# Altium schematic sheet ISP1507.SchDoc
size 420 x 297 mm; ApprovedBy: Утвердил; CheckedBy: Проверил; Author: Разработал; CompanyName: ВлГУ; DrawnBy: Н.Контр; Engineer: Т.Контр; SheetNumber: 2; SheetTotal: 1; PageSetup: Record=PageOptions|CenterHorizontal=True|CenterVertical=True|PrintScale=0.94|XCorrection=1.00|YCorrection=1.00|PrintKind=1|BorderSize=5000000|LeftOffset=0|BottomOffset=0|Orientation=1|PaperLength=1000|PaperWidth=1000|Scale=100|PaperSource=7|PrintQuality=-4|MediaType=1|DitherType=10|PaperKind=A4|PrintScaleMode=1; HeadOfSector: Нач. сектора; MainDevice: Перв.примен.; Name: Наименование; DocumentName: Sheet1.SCHDOC
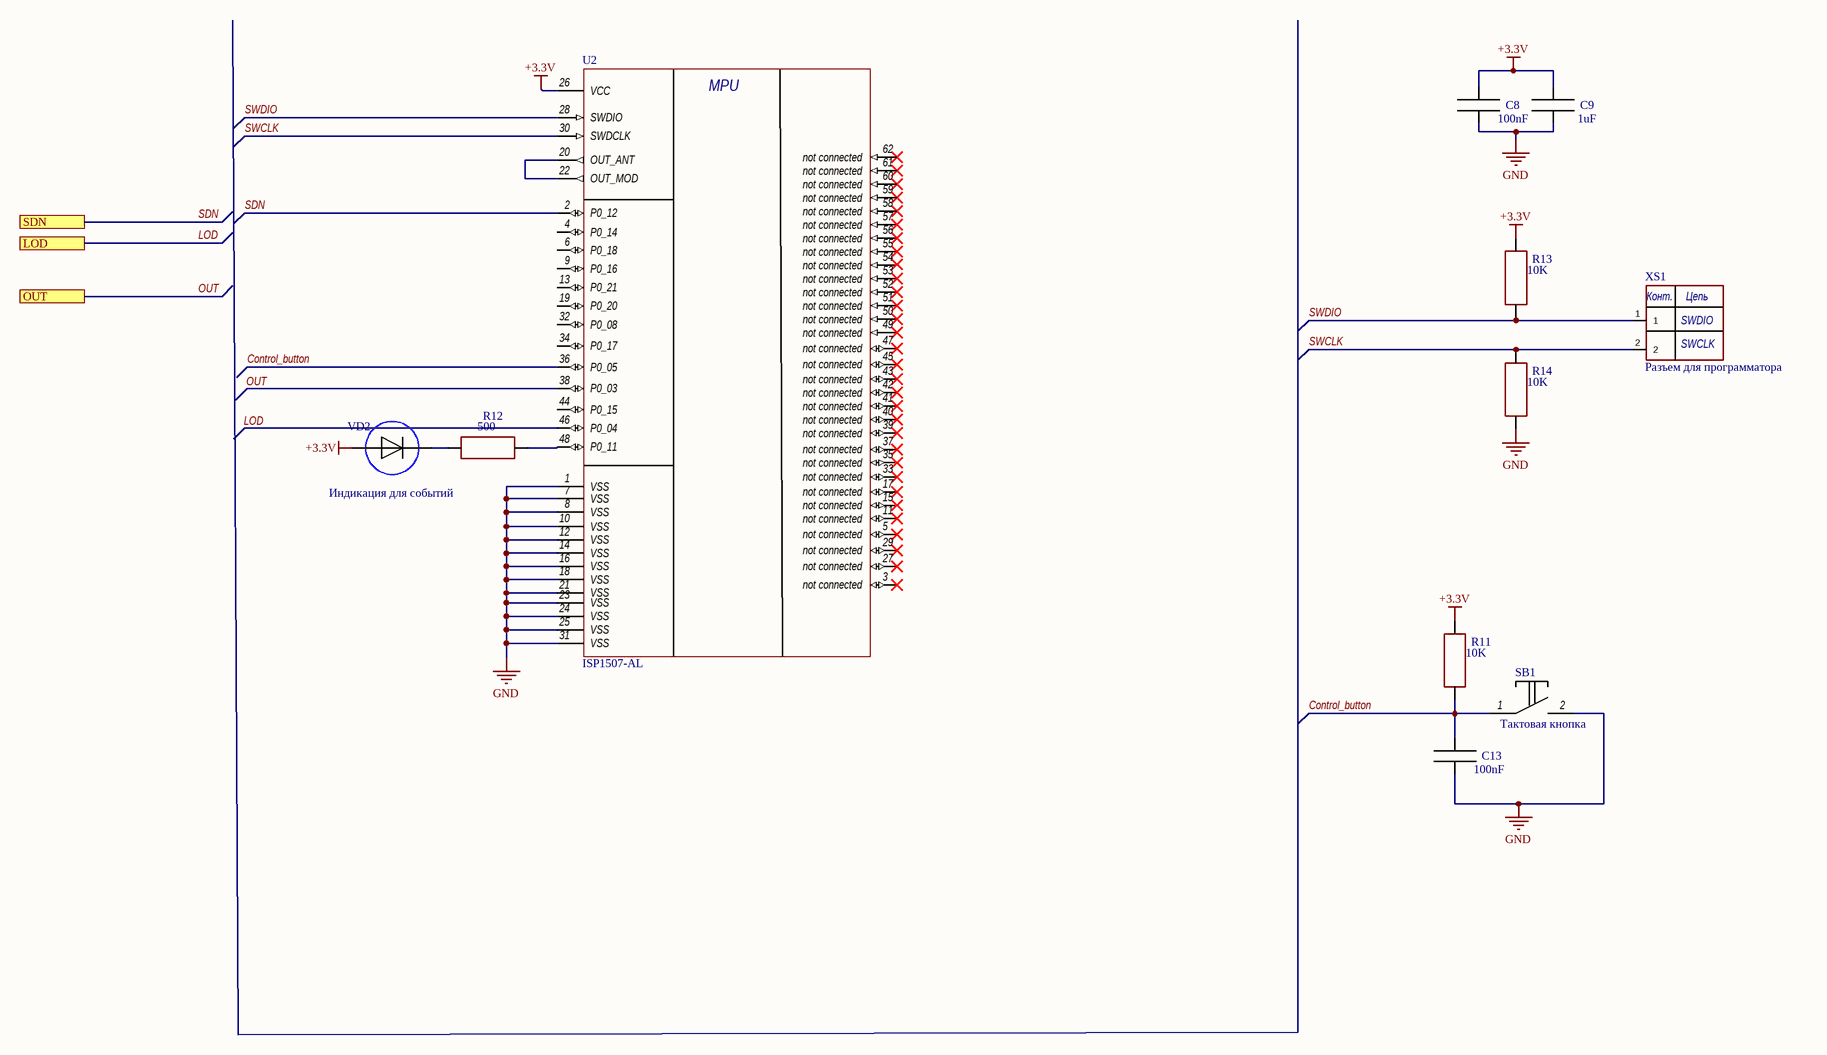
[diagram p0: ISP1507.SchDoc]

## Parts
C8  100nF  [0402]
C9  1uF  [0402]
C13  100nF  [0402]
R11  10K  [0402]
R12  500  [0402]
R13  10K  [0402]
R14  10K  [0402]
SB1  Тактовая кнопка  [2565]
U2  ISP1507-AL  [LGA QFN]
VD2  Event  [0402]  (value not drawn)
XS1  Разъем для программатора  [PIN 2]

## Ports
LOD, OUT, SDN

## Nets
+3.3V: C8.2 C9.2 R11.2 R13.2 U2.26(VCC) VD2.1
GND: C8.1 C9.1 C13.1 R14.1 SB1.2 U2.1(VSS) U2.7(VSS) U2.8(VSS) U2.10(VSS) U2.12(VSS) U2.14(VSS) U2.16(VSS) U2.18(VSS) U2.21(VSS) U2.23(VSS) U2.24(VSS) U2.25(VSS) U2.31(VSS)
Control_button: C13.2 R11.1 SB1.1 U2.36(P0_05)
LOD: port LOD
OUT: U2.38(P0_03) ; port OUT
SDN: U2.2(P0_12) ; port SDN
SWCLK: R14.2 U2.30(SWDCLK) XS1.2
SWDIO: R13.1 U2.28(SWDIO) XS1.1
NetR12_1: R12.1 U2.48(P0_11)
NetR12_2: R12.2 VD2.2
NetU2_20: U2.20(OUT_ANT) U2.22(OUT_MOD)

Not connected (* = marked no-connect by the designer): U2 3(not_connected)* 4(P0_14) 5(not_connected)* 6(P0_18) 9(P0_16) 11(not_connected)* 13(P0_21) 15(not_connected)* 17(not_connected)* 19(P0_20) 27(not_connected)* 29(not_connected)* 32(P0_08) 33(not_connected)* 34(P0_17) 35(not_connected)* 37(not_connected)* 39(not_connected)* 40(not_connected)* 41(not_connected)* 42(not_connected)* 43(not_connected)* 44(P0_15) 45(not_connected)* 46(P0_04) 47(not_connected)* 49(not_connected)* 50(not_connected)* 51(not_connected)* 52(not_connected)* 53(not_connected)* 54(not_connected) 55(not_connected)* 56(not_connected)* 57(not_connected)* 58(not_connected)* 59(not_connected)* 60(not_connected)* 61(not_connected)* 62(not_connected)*

## Notes on the sheet
- (near XS1) SWDIO
- (near XS1) SWCLK
- Индикация для событий
- Labels drawn without touching a wire or pin: LOD
- Подп. и дата
- Инв.№ дубл.
- Взам.инв.№
- Подп.и дата
- Инв.№ подл.
- Изм.
- Лист
- № докум.
- Подп.
- Дата
- Формат  A3
- (in symbol ISP1507) MPU
- (in symbol Разъем 2) Конт.; Цепь

## Library data of the parts
C8 C9 C13 = Конденсатор
R11-R14 = Резистор
U2 = ISP1507
VD2 = Светодиод
XS1 = Разъем 2